# EAGLE design mux_breakout (EAGLE 6.5.0)
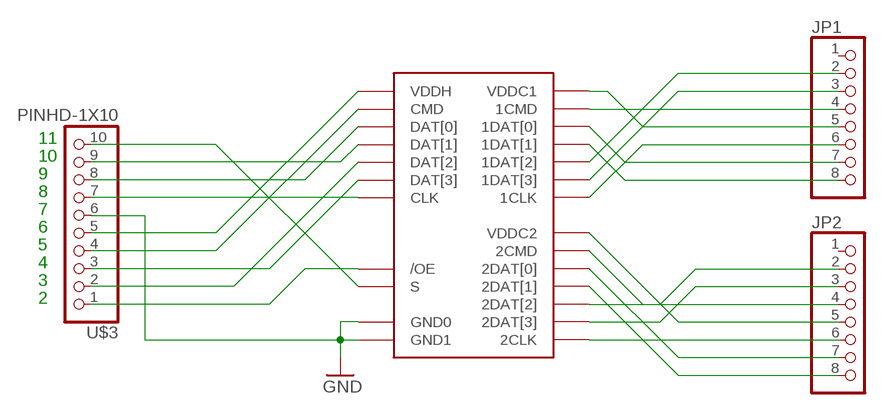
[diagram p0: schematic, sheet 1]

## Parts
JP1  PINHD-1X8CLEANBIG  [1X08-CLEANBIG]
JP2  PINHD-1X8CLEANBIG  [1X08-CLEANBIG]
U$1  FSSD06  [MLP-24]
U$3  PINHD-1X10  [1X10-BIG]

## Nets
1CLK: JP1.6 U$1.1CLK
1CMD: JP1.4 U$1.1CMD
1DAT[0]: JP1.7 U$1.1DAT[0]
1DAT[1]: JP1.8 U$1.1DAT[1]
1DAT[2]: JP1.2 U$1.1DAT[2]
1DAT[3]: JP1.3 U$1.1DAT[3]
2CLK: JP2.6 U$1.2CLCK(2CLK)
2CMD: JP2.4 U$1.2CMD
2DAT3: JP2.3 U$1.2DAT[3]
2DAT[0]: JP2.7 U$1.2DAT[0]
2DAT[1]: JP2.8 U$1.2DAT[1]
2DAT[2]: JP2.2 U$1.2DAT[2]
/OE: U$1./OE U$3.1
CLK: U$1.CLK U$3.7
CMD: U$1.CMD U$3.4
DAT[0]: U$1.DAT[0] U$3.8
DAT[1]: U$1.DAT[1] U$3.9
DAT[2]: U$1.DAT[2] U$3.2
DAT[3]: U$1.DAT[3] U$3.3
GND: U$1.GND0 U$1.GND1 U$3.6
S: U$1.S U$3.10
VDDC1: JP1.5 U$1.VDDC1
VDDC2: JP2.5 U$1.VDDC2
VDDH: U$1.VDDH U$3.5
Unconnected: JP1.1 JP2.1

## Notes on the sheet
- 11
- 10
- 9
- 8
- 7
- 6
- 5
- 4
- 3
- 2

## Library data of the parts
JP1 JP2 = adafruit:PINHD-1X8: PIN HEADER
U$1 = FSSD06_MLP24a:FSSD06
U$3 = adafruit:PINHD-1X10: Pin header 1x10 0.1" spacing With round pins

## Board
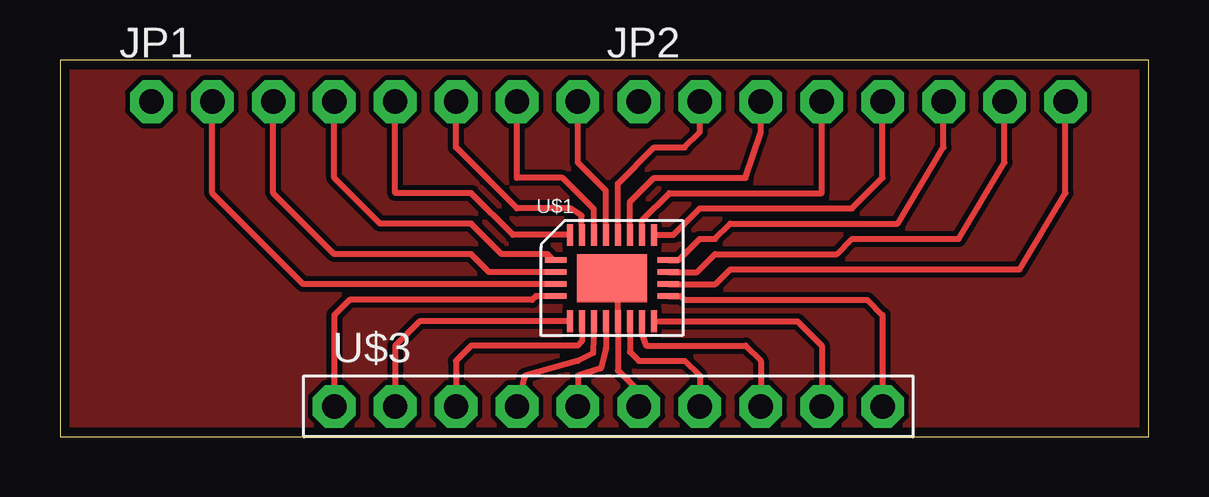
[diagram p1: board, top side]

Size 45.39 x 15.71 mm. Coordinates in mm from the lower left corner, seen from the top.
Outline: 0,0 45.39,0 45.39,15.71 0,15.71 0,0
Copper layers (1*16): Top 0.0178mm / dielectric 59mil / Bottom 0.0178mm
Design rules "epl-lpkf *": minimum track width 8mil, minimum drill 0.35mm, track to track 8mil, track to pad 8mil, pad to pad 8mil, via to via 8mil, smd to smd 8mil, copper to edge 15mil, drill to drill 15mil, minimum pad ring 8mil, minimum via ring 8mil, stop-mask expansion 3mil, vias tented up to drill 0mil, thermal gap 10mil

### Footprints (pad centres in the part's own frame; a part is rotated, then mirrored left to right if it is on the bottom)
1X08-CLEANBIG = drill 1.016 pad 1.778 octagon: 1 -8.89,0; 2 -6.35,0; 3 -3.81,0; 4 -1.27,0; 5 1.27,0; 6 3.81,0; 7 6.35,0; 8 8.89,0
MLP-24 = smd 0.24 x 0.9: 1CLK -1.1,0.8; 1DAT[0] -0.6,0.8; 1DAT[1] -0.1,0.8; 2CMD 1.4,0.8; 2DAT[2] 0.4,0.8; 2DAT[3] 0.9,0.8; CLK 0.9,-2.8; CMD -0.6,-2.8; DAT[0] 1.4,-2.8; DAT[1] 1.9,-2.8; DAT[2] -1.6,-2.8; DAT[3] -1.1,-2.8; GND0 0.4,-2.8; VDDC1 -1.6,0.8; VDDC2 1.9,0.8; VDDH -0.1,-2.8 | smd 0.9 x 0.24: 1CMD -2.2,-0.25; 1DAT[2] -2.2,-1.25; 1DAT[3] -2.2,-0.75; 2CLCK 2.5,-0.25; 2DAT[0] 2.5,-0.75; 2DAT[1] 2.5,-1.25; /OE -2.2,-1.75; S 2.5,-1.75 | smd 2.9 x 2: GND1 0.15,-1
1X10-BIG = drill 1.016 pad 1.778 octagon: 1 -11.43,0; 2 -8.89,0; 3 -6.35,0; 4 -3.81,0; 5 -1.27,0; 6 1.27,0; 7 3.81,0; 8 6.35,0; 9 8.89,0; 10 11.43,0

### Placement (x,y rotation side)
JP1  12.7,13.97 0 top
JP2  33.02,13.97 0 top
U$1  22.86,7.62 0 top
U$3  22.86,1.27 0 top

### Tracks (layer width: path | path; a pad name or v marks a point on that pad's centre or on a via)
1CLK
  Top 0.254: JP1.6 16.51,12.06 19.05,9.53 21.27,9.53 21.75,9.21 U$1.1CLK
1CMD
  Top 0.254: U$1.1CMD 20.57,7.37 20.32,7.62 18.41,7.62 17.14,8.89 13.34,8.89 11.43,10.79 JP1.4
1DAT[0]
  Top 0.254: U$1.1DAT[0] 22.26,9.49 20.95,10.79 19.05,10.79 JP1.7
1DAT[1]
  Top 0.254: U$1.1DAT[1] 22.76,10.26 21.59,11.43 JP1.8
1DAT[2]
  Top 0.254: U$1.1DAT[2] 10.14,6.37 6.35,10.16 JP1.2
1DAT[3]
  Top 0.254: U$1.1DAT[3] 17.89,6.87 17.14,7.62 11.43,7.62 8.89,10.16 JP1.3
2CLK
  Top 0.254: U$1.2CLCK 25.79,7.37 26.67,8.26 27.3,8.26 27.94,8.89 34.92,8.89 36.83,12.06 JP2.6
2CMD
  Top 0.254: U$1.2CMD 24.26,9.02 25.4,10.16 31.75,10.16 JP2.4
2DAT3
  Top 0.254: U$1.2DAT[3] 23.76,9.79 24.77,10.79 28.57,10.79 29.21,12.7 JP2.3
2DAT[0]
  Top 0.254: U$1.2DAT[0] 26.55,6.87 27.3,7.62 32.38,7.62 33.02,8.26 37.47,8.26 39.37,11.43 JP2.7
2DAT[1]
  Top 0.254: U$1.2DAT[1] 27.32,6.37 27.94,6.99 40.01,6.99 41.91,10.16 JP2.8
2DAT[2]
  Top 0.254: U$1.2DAT[2] 23.26,10.56 24.77,12.06 26.04,12.06 26.67,12.7 JP2.2
/OE
  Top 0.254: U$1./OE 19.84,5.87 19.68,5.71 12.06,5.71 11.43,5.08 U$3.1
CLK
  Top 0.254: U$1.CLK 23.76,3.54 24.13,3.17 26.04,3.17 26.67,2.54 U$3.7
CMD
  Top 0.254: U$1.CMD 22.23,3.49 21.59,3.17 19.37,2.54 U$3.4
DAT[0]
  Top 0.254: U$1.DAT[0] 24.26,4.32 24.45,3.81 28.57,3.81 29.21,3.17 U$3.8
DAT[1]
  Top 0.254: U$1.DAT[1] 30.74,4.82 31.75,3.81 U$3.9
DAT[2]
  Top 0.254: U$1.DAT[2] 14.98,4.82 13.97,3.81 U$3.2
DAT[3]
  Top 0.254: U$1.DAT[3] 21.76,3.98 21.59,3.81 17.14,3.81 16.51,3.17 U$3.3
GND
  Top 0.254: U$1.GND1 23.26,6.37 U$1.GND0 23.26,2.77 24.13,1.91 U$3.6
N$24
  pour Top: 0,0 0,15.24 45.72,15.24 45.72,0
S
  Top 0.254: U$1.S 25.88,5.87 26.04,5.71 33.66,5.71 34.29,5.08 U$3.10
VDDC1
  Top 0.254: U$1.VDDC1 18.89,8.42 17.14,10.16 13.97,10.16 JP1.5
VDDC2
  Top 0.254: U$1.VDDC2 25.57,8.42 26.67,9.53 33.02,9.53 34.29,10.79 JP2.5
VDDH
  Top 0.254: U$1.VDDH 22.76,3.71 22.54,2.86 21.59,2.54 U$3.5